# Altium schematic sheet Sheet1.SchDoc
size A4; SheetNumber: 1; SheetTotal: 1
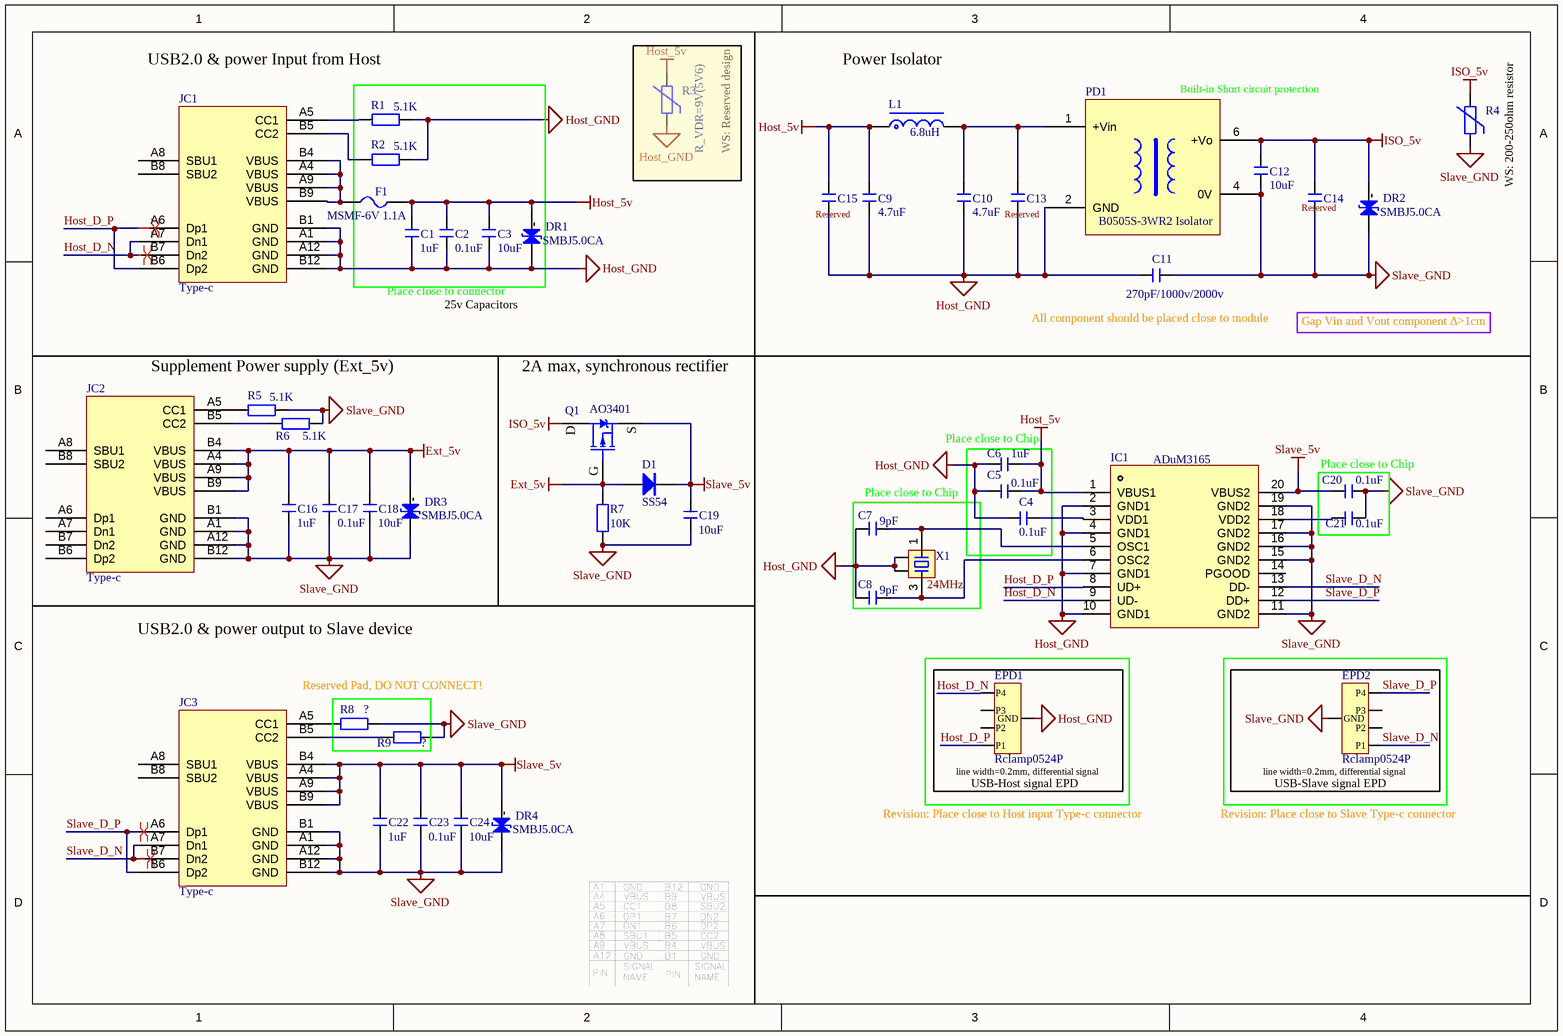
[diagram p0: Sheet1.SchDoc]

## Parts
C1  1uF  [0603]
C2  0.1uF  [0603]
C3  10uF  [0603]
C4  0.1uF  [0603]
C5  0.1uF  [0603]
C6  1uF  [0603]
C7  9pF  [0603]
C8  9pF  [0603]
C9  4.7uF  [0603]
C10  4.7uF  [0603]
C11  270pF/1000v/2000v  [1206R]
C12  10uF  [0603]
C13  Reserved  [0603]
C14  Reserved  [0603]
C15  Reserved  [0603]
C16  1uF  [0603]
C17  0.1uF  [0603]
C18  10uF  [0603]
C19  10uF  [0603]
C20  0.1uF  [0603]
C21  0.1uF  [0603]
C22  1uF  [0603]
C23  0.1uF  [0603]
C24  10uF  [0603]
D1  SS54  [SMA/DO-214AC]
DR1  SMBJ5.0CA  [SMB]
DR2  SMBJ5.0CA  [SMB]
DR3  SMBJ5.0CA  [SMB]
DR4  SMBJ5.0CA  [SMB]
EPD1  Rclamp0524P  [SLP2510P8]
EPD2  Rclamp0524P  [SLP2510P8]
F1  MSMF-6V 1.1A  [FU 1206]
IC1  ADuM3165  [SSOP20]
JC1  Type-c  [TYPE-C-SMD_TYPE-C-31-M-41]
JC2  Type-c  [TYPE-C-SMD_TYPE-C-31-M-41]
JC3  Type-c  [TYPE-C-SMD_TYPE-C-31-M-41]
L1  6.8uH  [CD43]
PD1  B0505S-3WR2 Isolator  [B0505S-3WR2 K-CUT]
Q1  AO3401  [SOT23]
R1  5.1K  [0603]
R2  5.1K  [0603]
R3  R_VDR=9V(5V6)  [1206R]
R4  (no value)  [1206R]
R5  5.1K  [0603]
R6  5.1K  [0603]
R7  10K  [0603]
R8  ?  [0603]
R9  ?  [0603]
X1  24MHz  [OSC 3225-4P]

## Blocks framed on the sheet
WS: Reserved design: R3
Place close to Chip: C7 C8 X1
Place close to Chip: C20 C21
USB-Host signal EPD: EPD1
USB-Slave signal EPD: EPD2

## Nets
Ext_5v: C16.1 C17.1 C18.1 D1.1(A) DR3.2(K) JC2.A4(VBUS) JC2.A9(VBUS) JC2.B4(VBUS) JC2.B9(VBUS) Q1.1(G) R7.1
Host_5v: C1.1 C2.1 C3.1 C5.2 C6.2 C9.1 C15.1 DR1.2(K) F1.2 IC1.1(VBUS1) L1.1 R3.2
Host_GND: C1.2 C2.2 C3.2 C4.2 C5.1 C6.1 C7.1 C8.1 C9.2 C10.2 C11.1 C13.2 C15.2 DR1.1(A) EPD1.3(GND) IC1.2(GND1) IC1.4(GND1) IC1.7(GND1) IC1.10(GND1) JC1.A1(GND) JC1.A12(GND) JC1.B1(GND) JC1.B12(GND) PD1.2(GND) R1.2 R2.2 R3.1 X1.2 X1.4
ISO_5v: C12.1 C14.1 DR2.2(K) PD1.6(+Vo) Q1.2(D) R4.2
Slave_5v: C19.1 C20.2 C22.1 C23.1 C24.1 D1.2(K) DR4.2(K) IC1.20(VBUS2) JC3.A4(VBUS) JC3.A9(VBUS) JC3.B4(VBUS) JC3.B9(VBUS) Q1.3(S)
Slave_GND: C11.2 C12.2 C14.2 C16.2 C17.2 C18.2 C19.2 C20.1 C21.2 C22.2 C23.2 C24.2 DR2.1(A) DR3.1(A) DR4.1(A) EPD2.3(GND) IC1.11(GND2) IC1.15(GND2) IC1.16(GND2) IC1.17(GND2) IC1.19(GND2) JC2.A1(GND) JC2.A12(GND) JC2.B1(GND) JC2.B12(GND) JC3.A1(GND) JC3.A12(GND) JC3.B1(GND) JC3.B12(GND) PD1.4(0V) R4.1 R5.2 R6.2 R7.2 R8.2 R9.2
Host_D_N: EPD1.5(P4) IC1.9(UD-) JC1.A7(Dn1) JC1.B7(Dn2)
Host_D_P: EPD1.1(P1) IC1.8(UD+) JC1.A6(Dp1) JC1.B6(Dp2)
Slave_D_N: EPD2.1(P1) IC1.13(DD-) JC3.A7(Dn1) JC3.B7(Dn2)
Slave_D_P: EPD2.5(P4) IC1.12(DD+) JC3.A6(Dp1) JC3.B6(Dp2)
NetC4_1: C4.1 IC1.3(VDD1)
NetC7_2: C7.2 IC1.5(OSC1) X1.1
NetC8_2: C8.2 IC1.6(OSC2) X1.3
NetC10_1: C10.1 C13.1 L1.2 PD1.1(+Vin)
NetC21_1: C21.1 IC1.18(VDD2)
NetF1_1: F1.1 JC1.A4(VBUS) JC1.A9(VBUS) JC1.B4(VBUS) JC1.B9(VBUS)
NetJC1_A5: JC1.A5(CC1) R1.1
NetJC1_B5: JC1.B5(CC2) R2.1
NetJC2_A5: JC2.A5(CC1) R5.1
NetJC2_B5: JC2.B5(CC2) R6.1
NetJC3_A5: JC3.A5(CC1) R8.1
NetJC3_B5: JC3.B5(CC2) R9.1

Not connected (* = marked no-connect by the designer): EPD1 2(P2) 4(P3); EPD2 2(P2) 4(P3); IC1 14(PGOOD); JC1 A8(SBU1) B8(SBU2); JC2 A6(Dp1) A7(Dn1) A8(SBU1) B6(Dp2) B7(Dn2) B8(SBU2); JC3 A8(SBU1) B8(SBU2)

## Layout directives
differential pair: Host_D_N, Host_D_P, Slave_D_N, Slave_D_P

## Notes on the sheet
- USB2.0 & power Input from Host
- Power Isolator
- (near PD1) Built-in Short circuit protection
- (near R4) WS: 200-250ohm resistor
- Place close to connector
- 25v Capacitors
- Supplement Power supply (Ext_5v)
- (near Q1) 2A max, synchronous rectifier
- (near C11) All component should be placed close to module
- Gap Vin and Vout component Δ>1cm
- (near C6) Place close to Chip
- USB2.0 & power output to Slave device
- Reserved Pad, DO NOT CONNECT!
- (near EPD1) line width=0.2mm, differential signal
- (near EPD2) line width=0.2mm, differential signal
- Revision: Place close to Host input Type-c connector
- Revision: Place close to Slave Type-c connector
- THIS DOCUMENT AND THE DATA DISCLOSED HEREIN OR
- HEREWITH IS THE PROPERTY OF ALTIUM LIMITED AND MAY
- DWG NO:
- REVISION
- REV:
- DESCRIPTION
- DATE
- APPROVED
- BE FREELY DISTRIBUTED IN WHOLE. NO RIGHTS ARE
- RESERVED OR EXPRESS OR IMPLIED WARANTEE GIVEN.
- ENG:
- APPROVALS
- PROJECT
- DSN:
- CHK:
- REFERENCE DOCUMENTS
- PROJECT REVISION:
- TITLE
- DOCUMENT REVISION:
- DESIGN ITEM:
- BOM:
- FAB DWG:
- PCB DWG:
- ASSY DWG:
- SCALE:
- A3
- SIZE
- CAGE CODE
- FILE NAME
- DWG NO.
- SHEET
- OF
- REV

## Library data of the parts
C1-C24 = C: 无极性贴片电容; 版权归属: 源创客; BOM名称: 无极性贴片电容; 学习资源: www.ooocke.com
D1 = SS54: 肖特基二极管; BOM名称: 整流二极管; 版权归属: 源创客; 学习资源: www.ooocke.com
DR1-DR4 = SMBJ5.0CA: 瞬态电压抑制二极管; 版权归属: 源创客; BOM名称: 瞬态电压抑制二极管; 学习资源: www.ooocke.com
EPD1 EPD2 = Rclamp0524P: Rclamp0524P  Ultra Low Capacitance TVS Arrays
F1 = FU: 贴片保险丝; 版权归属: 源创客; BOM名称: 贴片保险丝; 学习资源: www.ooocke.com
IC1 = ADuM3165: 3.75kV RMS Digital Isolators for USB2.0 High Speed
L1 = L-CD: 贴片功率电感; BOM名称: 功率电感; 版权归属: 源创客; 学习资源: www.ooocke.com
PD1 = B0505S-3WR2: K-CUT 05v - 05v power isolator
Q1 = AO3401: P沟增强型场效应管; BOM名称: P沟场效应管; 版权归属: 源创客; 学习资源: www.ooocke.com
R1 R2 R5-R9 = R: 贴片电阻; 版权归属: 源创客; BOM名称: 贴片电阻; 学习资源: www.ooocke.com
R3 R4 = R_VDR: 压敏电阻; 版权归属: 源创客; BOM名称: 压敏电阻; 学习资源: www.ooocke.com
X1 = XTAL-4P: 4脚无源晶振; 版权归属: 源创客; BOM名称: 4脚无源晶振; 学习资源: www.ooocke.com